# EAGLE design esprog (EAGLE 6.5.0)
CNAME: An ESP8266 programming adapter; CREVISION: 1; DESIGNER: Johan Kanflo
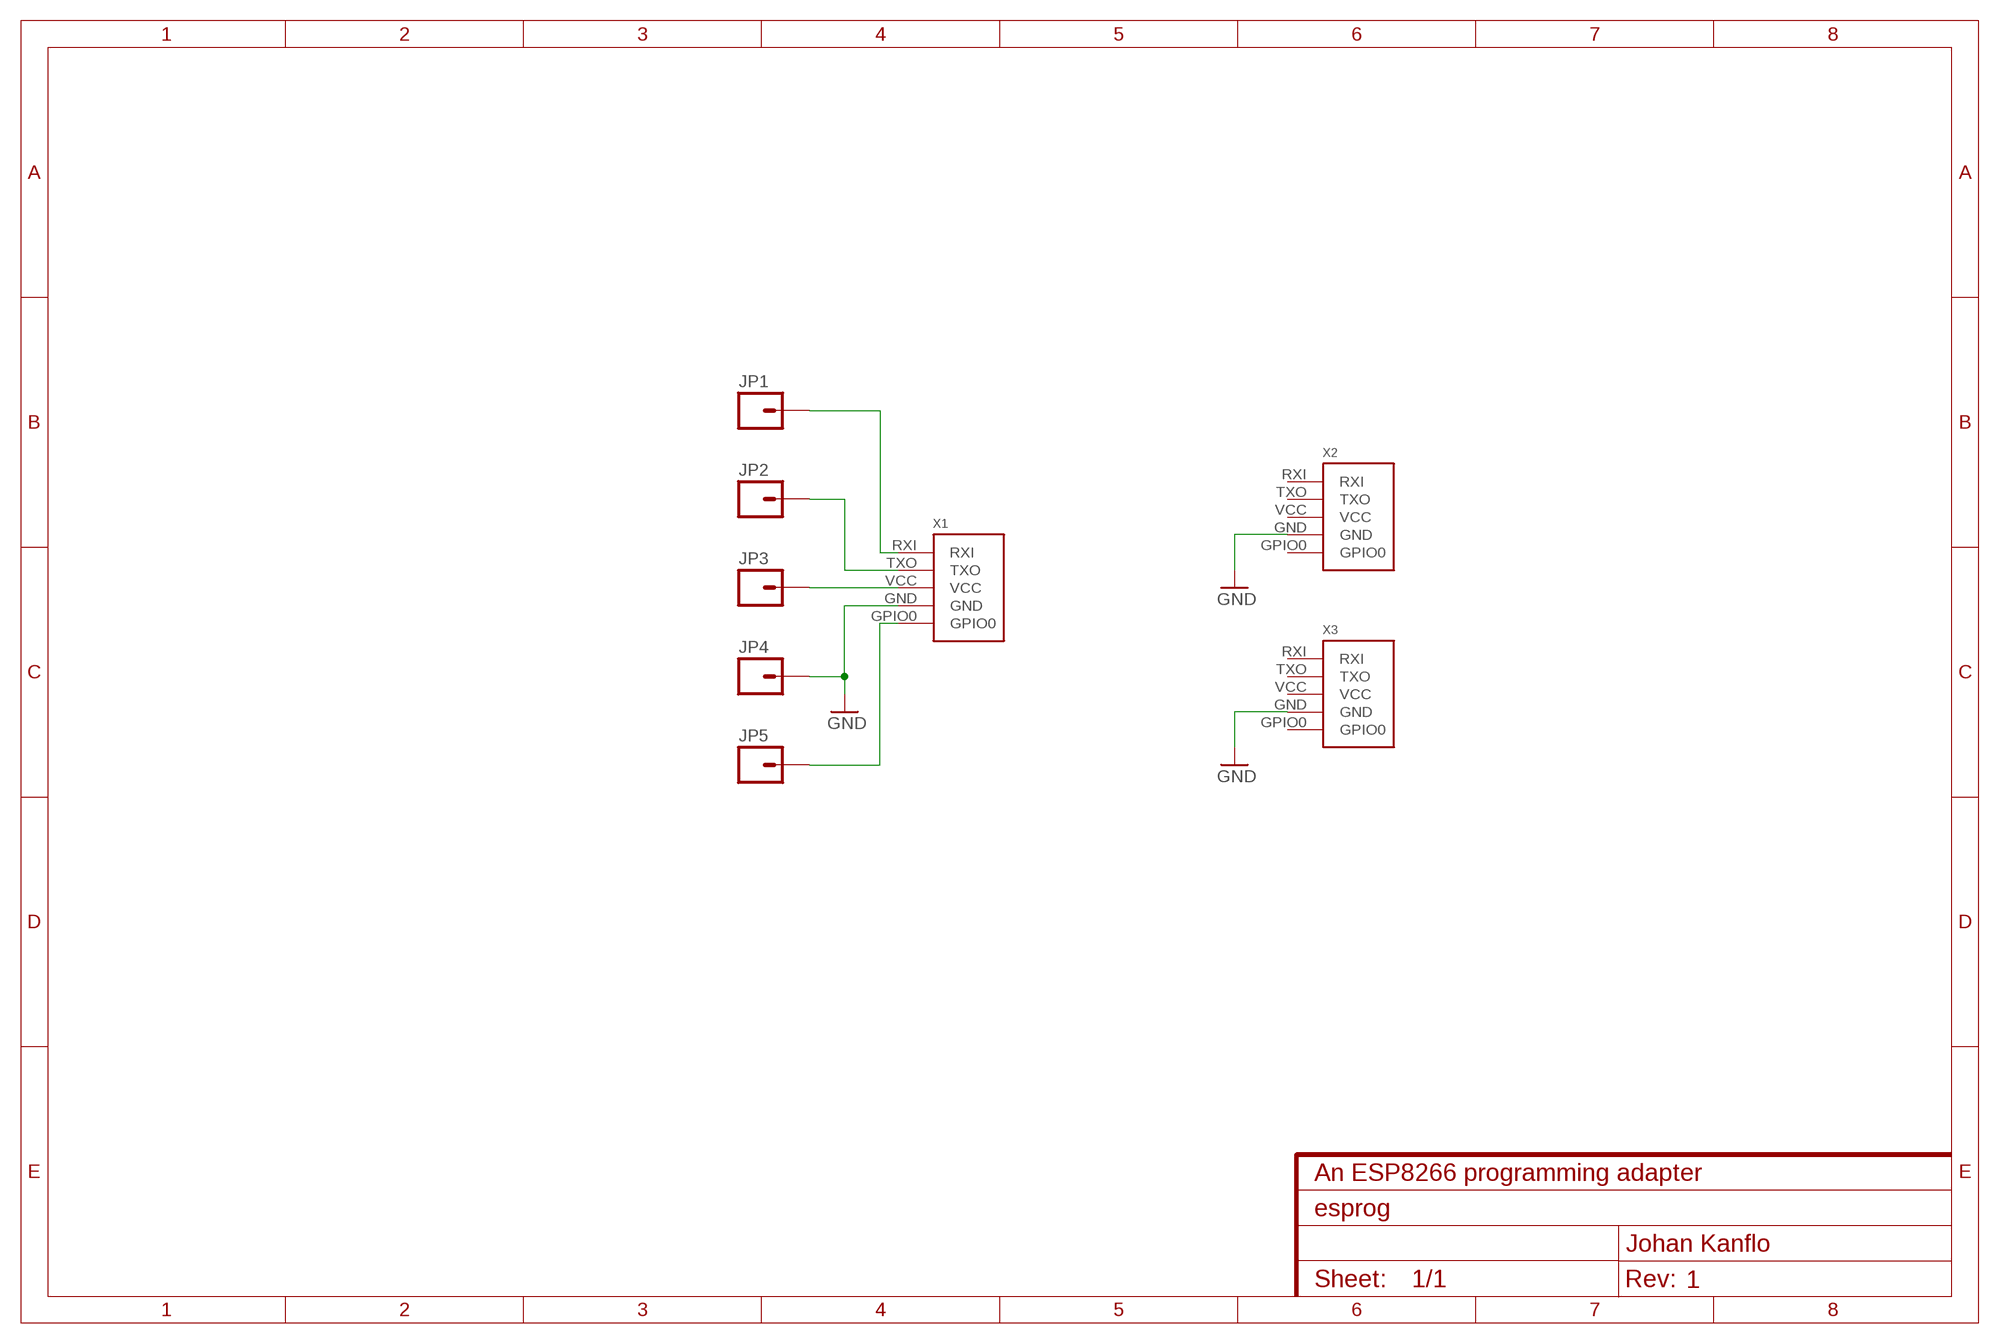
[diagram p0: schematic, sheet 1]

## Parts
JP1  M01PTH_NO_SILK_YES_STOP  [1X01_NO_SILK]
JP2  M01PTH_NO_SILK_YES_STOP  [1X01_NO_SILK]
JP3  M01PTH_NO_SILK_YES_STOP  [1X01_NO_SILK]
JP4  M01PTH_NO_SILK_YES_STOP  [1X01_NO_SILK]
JP5  M01PTH_NO_SILK_YES_STOP  [1X01_NO_SILK]
X1  ESPROGESPROG-CONNECTOR  [ESPROG-TH]
X2  ESPROGESPROG-CONNECTOR  [ESPROG-TH]
X3  ESPROGESPROG-CONNECTOR  [ESPROG-TH]

## Nets
GND: JP4.1 X1.GND X2.GND X3.GND
N$1: JP1.1 X1.RXI
N$2: JP2.1 X1.TXO
N$3: JP3.1 X1.VCC
N$5: JP5.1 X1.GPIO0
Unconnected: X2.GPIO0 X2.RXI X2.TXO X2.VCC X3.GPIO0 X3.RXI X3.TXO X3.VCC

## Library data of the parts
JP1-JP5 = SparkFun-Connectors:M01: Header 1 Standard 1-pin 0.1" header. Use with straight break away headers (SKU : PRT-00116), right angle break away headers (PRT-00553), swiss pins (PRT-00743), machine pins (PRT-00117), and female headers (PRT-00115).
X1-X3 = kanflo:ESPROG

## Board
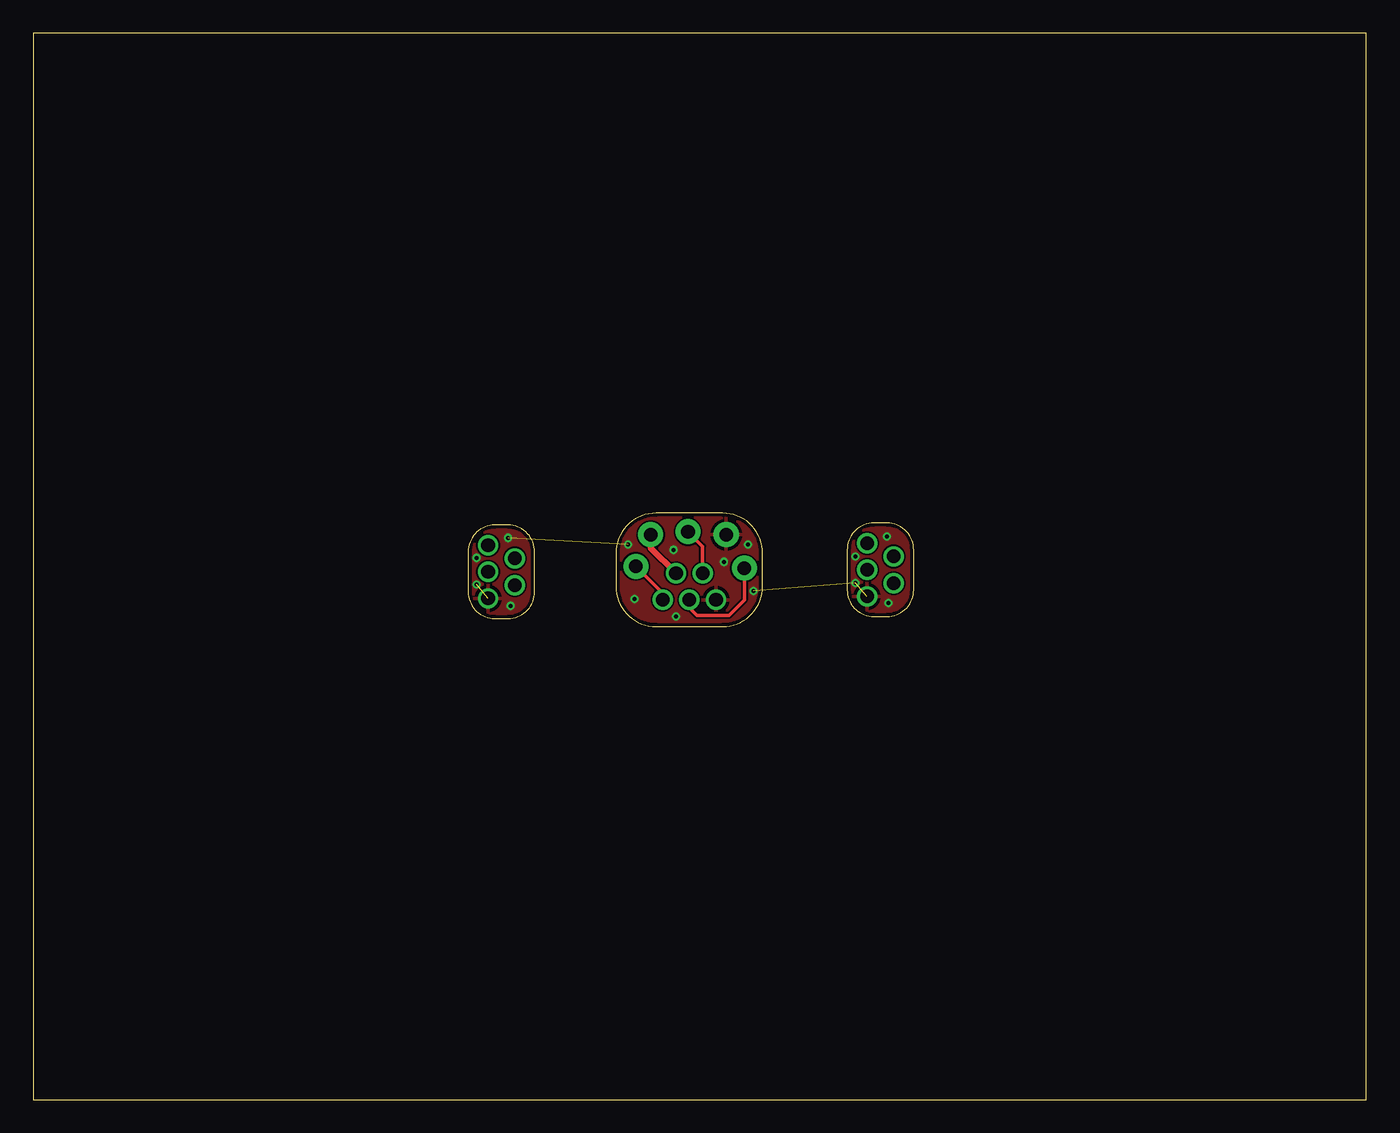
[diagram p1: board, top side]
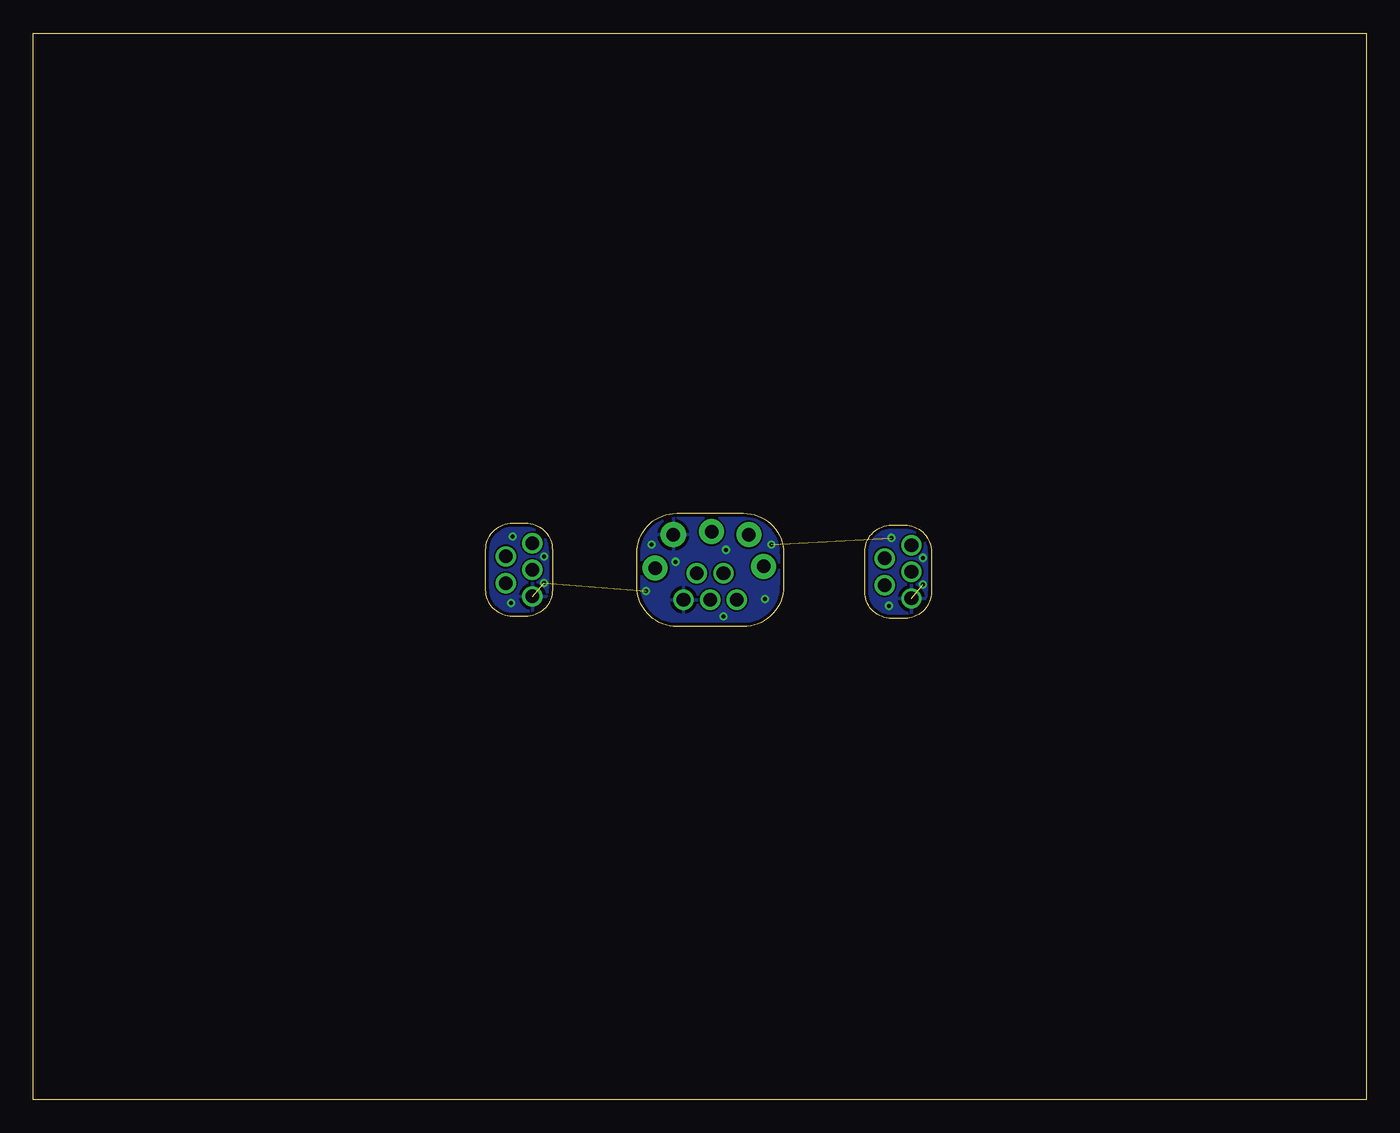
[diagram p2: board, bottom side, seen from below]

Size 100 x 80 mm. Coordinates in mm from the lower left corner, seen from the top.
Outline: 0,0 100,0 100,80 0,80 0,0
Outline: 61.05,41.25 61.05,38.25 arc90 63.05,36.25 64.05,36.25 arc90 66.05,38.25 66.05,41.25 arc90 64.05,43.25 63.05,43.25 arc90 61.05,41.25
Outline: 51.72,44 46.72,44 arc90 43.72,41 43.72,38.5 arc90 46.72,35.5 51.72,35.5 arc90 54.72,38.5 54.72,41 arc90 51.72,44
Outline: 35.62,43.1 34.62,43.1 arc90 32.62,41.1 32.62,38.1 arc90 34.62,36.1 35.62,36.1 arc90 37.62,38.1 37.62,41.1 arc90 35.62,43.1
Copper layers (1*16): Top 0.035mm / dielectric 1.5mm / Bottom 0.035mm
Design rules "dirt_cheap_dirty_boards.v1": minimum track width 5mil, minimum drill 12mil, track to track 5mil, track to pad 5mil, pad to pad 5mil, via to via 5mil, smd to smd 0mil, copper to edge 10mil, drill to drill 10mil, minimum pad ring 10mil, minimum via ring 6mil, stop-mask expansion 2mil, vias tented up to drill 25mil, thermal gap 10mil

### Footprints (pad centres in the part's own frame; a part is rotated, then mirrored left to right if it is on the bottom)
1X01_NO_SILK = drill 1.016 pad 1.88: 1 0,0
ESPROG-TH = drill 1.016 pad 1.422: GND -1,-2; GPIO0 1,-1; RXI -1,2; TXO -1,0; VCC 1,1

### Placement (x,y rotation side)
JP1  45.22,40 90 top
JP2  53.35,39.87 90 top
JP3  46.32,42.38 90 top
JP4  51.99,42.38 90 top
JP5  49.12,42.6 0 top
X1  49.22,38.5 90 top
X2  63.55,39.75 0 top
X3  35.12,39.6 0 top

### Tracks (layer width: path | path; a pad name or v marks a point on that pad's centre or on a via)
GND  (via drill 0.3 pad 0.25)  (4 unrouted)
  other vias: 44.62,41.65 45.12,37.55 48.02,41.25 48.22,36.25 51.82,40.35 53.62,41.65 54.02,38.15 33.25,38.65 33.25,40.65 35.62,42.15 35.82,37.05 61.68,40.75 61.68,38.75 64.05,42.25 64.15,37.25
  pour Bottom (rank 6): 43.72,43.95 54.72,43.95 54.72,35.55 43.72,35.55
  pour Top (rank 6): 43.72,43.95 54.72,43.95 54.72,35.55 43.72,35.55
  pour Top (rank 6): 61.05,43.25 66.05,43.25 66.05,36.25 61.05,36.25
  pour Bottom (rank 6): 61.05,43.25 66.05,43.25 66.05,36.25 61.05,36.25
  pour Bottom (rank 6): 32.62,43.15 37.62,43.15 37.62,36.15 32.62,36.15
  pour Top (rank 6): 32.62,43.15 37.62,43.15 37.62,36.15 32.62,36.15
N$1
  Top 0.254: X1.RXI 47.22,37.99 JP1.1
N$2
  Top 0.254: JP2.1 53.35,37.48 52.2,36.32 49.78,36.32 49.28,36.83 49.28,37.44 X1.TXO
N$3
  Top 0.406: JP3.1 46.32,41.4 X1.VCC
N$5
  Top 0.254: X1.GPIO0 50.22,41.5 JP5.1